# Altium schematic sheet STM32RF_MCU.SchDoc
size A4; SheetNumber: 2; SheetTotal: 5
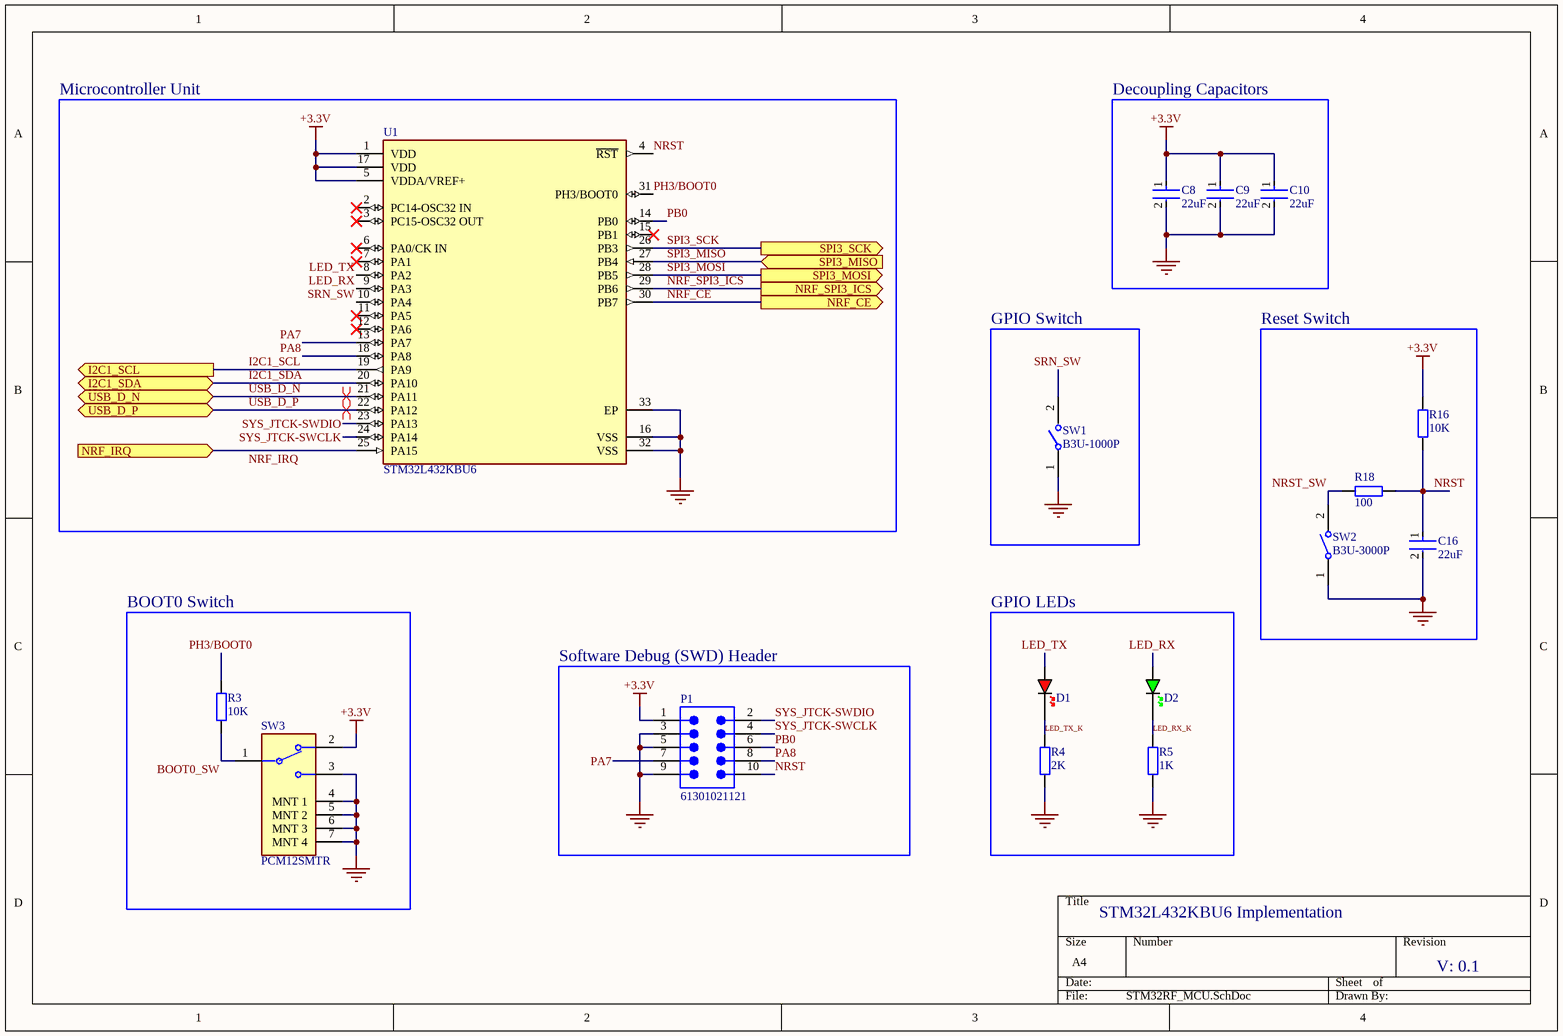
[diagram p0: STM32RF_MCU.SchDoc]

## Parts
C8  22uF  [FP-GRM158-0_2-MFG]
C9  22uF  [FP-GRM158-0_2-MFG]
C10  22uF  [FP-GRM158-0_2-MFG]
C16  22uF  [FP-GRM158-0_2-MFG]
D1  RED  [LED_0402_RED]  (value not drawn)
D2  GREEN  [LED_0402_GREEN]  (value not drawn)
P1  61301021121  [61301021121]
R3  10K  [RES_0402]
R4  2K  [RES_0402]
R5  1K  [RES_0402]
R16  10K  [RES_0402]
R18  100  [RES_0402]
SW1  B3U-1000P  [FP-B3U-1000P-MFG]
SW2  B3U-3000P  [OMRON-B3U-3000P_V]
SW3  PCM12SMTR  [FP-PCM12SMTR-MFG]
U1  STM32L432KBU6  [FP-UFQFPN32-A0B8-MFG]

## Blocks framed on the sheet
Microcontroller Unit: U1
Decoupling Capacitors: C8-C10
GPIO Switch: SW1
Reset Switch: C16 R16 R18 SW2
BOOT0 Switch: R3 SW3
GPIO LEDs: D1 D2 R4 R5
Software Debug (SWD) Header: P1

## Ports
I2C1_SCL (out, see STM32RF_TopLevel[2C], STM32RF_BME280[2C]), I2C1_SDA (bidir, see STM32RF_TopLevel[2C], STM32RF_BME280[2C]), NRF_CE (out, see STM32RF_TopLevel[3C], STM32RF_NRF[1A]), NRF_IRQ (in, see STM32RF_TopLevel[3C], STM32RF_NRF[2A]), NRF_SPI3_ICS (out, see STM32RF_TopLevel[3B], STM32RF_NRF[1A]), SPI3_MISO (in, see STM32RF_TopLevel[3B], STM32RF_NRF[1A]), SPI3_MOSI (out, see STM32RF_TopLevel[3B], STM32RF_NRF[1A]), SPI3_SCK (out, see STM32RF_TopLevel[3B], STM32RF_NRF[1A]), USB_D_N (bidir, see STM32RF_TopLevel[2B], STM32RF_PowerUSBSchDoc[2A]), USB_D_P (bidir, see STM32RF_TopLevel[2B], STM32RF_PowerUSBSchDoc[2A])

## Nets
+3.3V: C8.1 C9.1 C10.1 P1.1 R16.2 SW3.2 U1.1(VDD) U1.5(VDDA/VREF+) U1.17(VDD)
GND: C8.2 C9.2 C10.2 C16.2 P1.3 P1.5 P1.9 R4.1 R5.1 SW1.1 SW2.1 SW3.3 SW3.4(MNT_1) SW3.5(MNT_2) SW3.6(MNT_3) SW3.7(MNT_4) U1.16(VSS) U1.32(VSS) U1.33(EP)
BOOT0_SW: R3.1 SW3.1
I2C1_SCL: U1.19(PA9) ; port I2C1_SCL
I2C1_SDA: U1.20(PA10) ; port I2C1_SDA
LED_RX: D2.A U1.9(PA3)
LED_RX_K: D2.K R5.2
LED_TX: D1.A U1.8(PA2)
LED_TX_K: D1.K R4.2
NRF_CE: U1.30(PB7) ; port NRF_CE
NRF_IRQ: U1.25(PA15) ; port NRF_IRQ
NRF_SPI3_ICS: U1.29(PB6) ; port NRF_SPI3_ICS
NRST: C16.1 P1.10 R16.1 R18.1 U1.4(~{RST})
NRST_SW: R18.2 SW2.2
PA7: P1.7 U1.13(PA7)
PA8: P1.8 U1.18(PA8)
PB0: P1.6 U1.14(PB0)
PH3/BOOT0: R3.2 U1.31(PH3/BOOT0)
SPI3_MISO: U1.27(PB4) ; port SPI3_MISO
SPI3_MOSI: U1.28(PB5) ; port SPI3_MOSI
SPI3_SCK: U1.26(PB3) ; port SPI3_SCK
SRN_SW: SW1.2 U1.10(PA4)
SYS_JTCK-SWCLK: P1.4 U1.24(PA14)
SYS_JTCK-SWDIO: P1.2 U1.23(PA13)
USB_D_N: U1.21(PA11) ; port USB_D_N
USB_D_P: U1.22(PA12) ; port USB_D_P

Not connected (* = marked no-connect by the designer): U1 2(PC14-OSC32_IN)* 3(PC15-OSC32_OUT)* 6(PA0/CK_IN)* 7(PA1)* 11(PA5)* 12(PA6)* 15(PB1)*

## Layout directives
differential pair: USB_D_N, USB_D_P

## Notes on the sheet
- STM32L432KBU6 Implementation
- V: 0.1

## Library data of the parts
C8-C10 C16 = CMP-06035-020400-1: Chip Multilayer Ceramic Capacitors for General Purpose, 0402, 22uF, X5R, 15%, 20%, 10V
D1 = LED_0402_RED: LED 0402 RED SMD
D2 = LED_0402_GREEN: LED 0402 GREEN SMD
P1 = CMP-1502-01084-4: THT Vertical Pin Header WR-PHD, Pitch 2.54 mm, Dual Row, 10 pins; Insulation Resistance: 1GΩ; Connector Type: Male Pin; Number of Contacts: 10; Pitch: 2.54mm; Contact Resistance: 20mΩ; Current Rating: 3A; Gender: Male; Insulation: Insulated; Voltage Rating: 250V; Mount: Through Hole; Orientation: Vertical; Max Operating Temperature: 105°C; Height: 8.89mm; Number of Pins: 10; Housing Material: PBT; Number of Positions: 10; Packaging: Bulk; RoHS: Compliant; Contact Mating Length: 5.9944mm; Lead Pitch: 2.54mm; Contact Gender: Male; Flammability Rating: UL94 V-0; Color: Black; Termination: Through Hole; Width: 12.7mm; Number of Rows: 2; Contact Material: Gold; Contact Plating: Gold; Operating Supply Voltage: 250V; Length: 12.7mm; Min Operating Temperature: -40°C; Row Spacing: 2.54mm
R3-R5 R16 R18 = RES_0402: Resistor SMD 0402; Manufacturer: *; Manufacturer Part Number: *; Distributor Link: *; LCSC: *
SW1 = CMP-2100-03586-2: SWITCH TACTILE SPST-NO 0.05A 12V; Contact Resistance: 100mR; Operating Force: 1.5N; Max Current Rating: 50mA; Switch Travel: 0.15mm; Actuator Type: Standard; Mechanical Life: 200000Cycles; Ratings: Dust Proof; Illumination Type: Non-Illuminated; Throw Configuration: SPST; Actuator Length: 0.4mm; Switch Function: Off-Mom; Height: 1.2mm; Width: 3mm; Weight: 0.000776oz; Contact Material: Silver; Max Voltage Rating (DC): 12V; Insulation Resistance: 100MR; Lead Free: Lead Free; Current Rating: 50mA; Termination: SMD/SMT; Length: 4mm; Voltage Rating (DC): 12V; Contact Current Rating: 50mA; Orientation: Straight; Depth: 2.5mm; Max Operating Temperature: 70°C; Packaging: Tape and Reel; Min Operating Temperature: -25°C; Package Quantity: 1; Mount: Surface Mount; Electrical Life: 200000Cycles
SW2 = CMP-1677-00003-1: Ultra-Small Tactile Switch, 1 to 50 mA, 3 to 12 V, -25 to 70 degC, 2-Pin SMD, RoHS, Tape and Reel; Tolerance: 20%; Voltage Rating (DC): 50 V; Capacitance: 470 uF; Case\Package: Radial; PackageReference: B3U-3000P; Min Operating Temperature: -40 degC; Length: 20 mm; Mount: Through Hole; ComponentLink2Description: Datasheet; RoHSCompliant: true; ComponentLink1URL: http://www.omron.com/; Package Quantity: 200; Radiation Hardening: No; Height: 20 mm; ComponentLink2URL: https://www.omron.com/ecb/products/pdf/en-b3u.pdf; Diameter: 10 mm; Max Operating Temperature: 85 degC; Lead Pitch: 5 mm; DatasheetVersion: Jan-15; Packaging: Bulk; PackageDescription: 2-Pin Surface Mount Device, Body 4 x 3.2 mm; Voltage Rating: 50 V; Pins: 2; ComponentLink1Description: Manufacturer URL; REACH SVHC: No SVHC
SW3 = CMP-2000-06884-2: SWITCH SLIDE SPDT 300MA 6V; Actuator Material: Nylon; Switch Function: On-On; Insulation Resistance: 100mR; Actuator Type: Standard; Mechanical Life: 10000Cycles; Actuator Length: 1.5mm; Contact Resistance: 70mR; Min Operating Temperature: -20°C; Max Current Rating: 300mA; Max Voltage Rating (DC): 6V; Package Quantity: 1; Mount: Surface Mount; Packaging: Tape and Reel; Contact Plating: Silver; Depth: 5mm; REACH SVHC: No SVHC; Voltage Rating (DC): 6V; Voltage Rating (AC): 6V; Max Operating Temperature: 85°C; Length: 7.7mm; Termination: Gull Wing; Current Rating: 300mA; Contact Current Rating: 300mA; Orientation: Right Angle; Width: 6.7mm; Switch Travel: 1.5mm; Lead Free: Lead Free; Contact Material: Copper Alloy; Throw Configuration: SPDT
U1 = CMP-12105-000014-1: IC MCU 32BIT 128KB FLASH 32QFPN; Manufacturer: STMicroelectronics; Memory Size: 128KBytes; Number Of I/Os: 26; Max Supply Voltage: 3.6V; Core Architecture: ARM Cortex-M4; Number Of A/D Converters: 1; Number Of Timers/Counters: 8; Min Supply Voltage: 1.62V; Interface: I2C,SPI,UART,USART,USB,IrDA; Number Of Spi Channels: 2; Frequency: 80MHz; Max Junction Temp: +105°C; Number Of Adc Channels: 10; Ram Size: 64KBytes; Data Bus Width: 32bits; Ambient Temperature Range High: +85°C; Device Class L2: Embedded Processors and Controllers; Temperature: -40°C to +85°C; Category: IC; ComponentLink2URL: https://www.st.com/resource/en/datasheet/stm32l432kb.pdf; Device Class L1: Integrated Circuits (ICs); ComponentLink2Description: Datasheet; Memory Type: FLASH; Ipc Land Pattern Name: QFN50P500X500X55-32; Temperature Range Low: -40°C; Height: 0.6mm; Digikey Description: IC MCU 32BIT 128KB FLASH 32QFPN; Temperature Range High: +85°C; Device Class L3: Microcontrollers; Lead Free: Yes; RoHS: TRUE; Octopart: https://octopart.com/stm32l432kbu6-stmicroelectronics-74568735; Manufacturer Part Number: STM32L432KBU6; Number Of Uart Channels: 1; Ambient Temperature Range Low: -40°C; Package: UFQFPN32-A0B8; Number Of I2C Channels: 2; Number Of Cores: 1; Automotive: No